# EAGLE schematic BLT_Preliminary_Avionics_Schematic_Brandon_update_August_8_2021 (EAGLE 9.6.2)
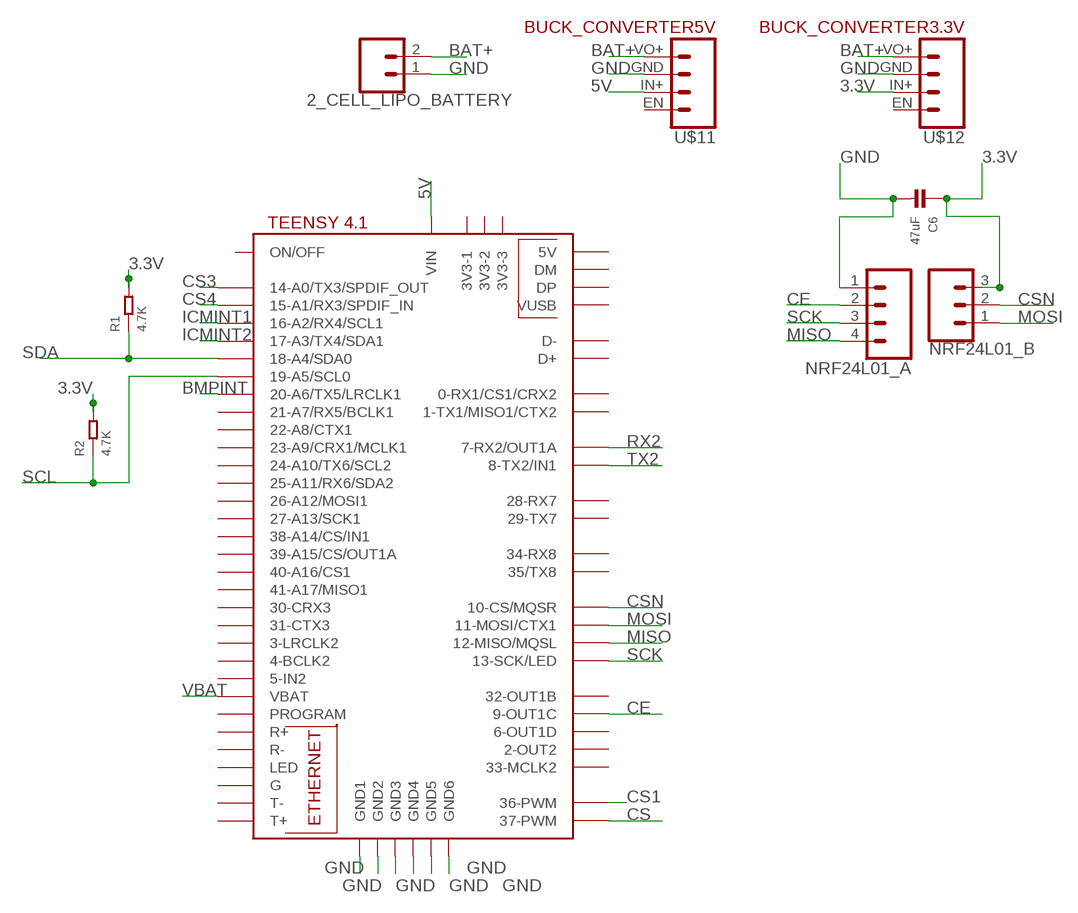
[diagram p0: schematic, sheet 1, part 1 of 2]
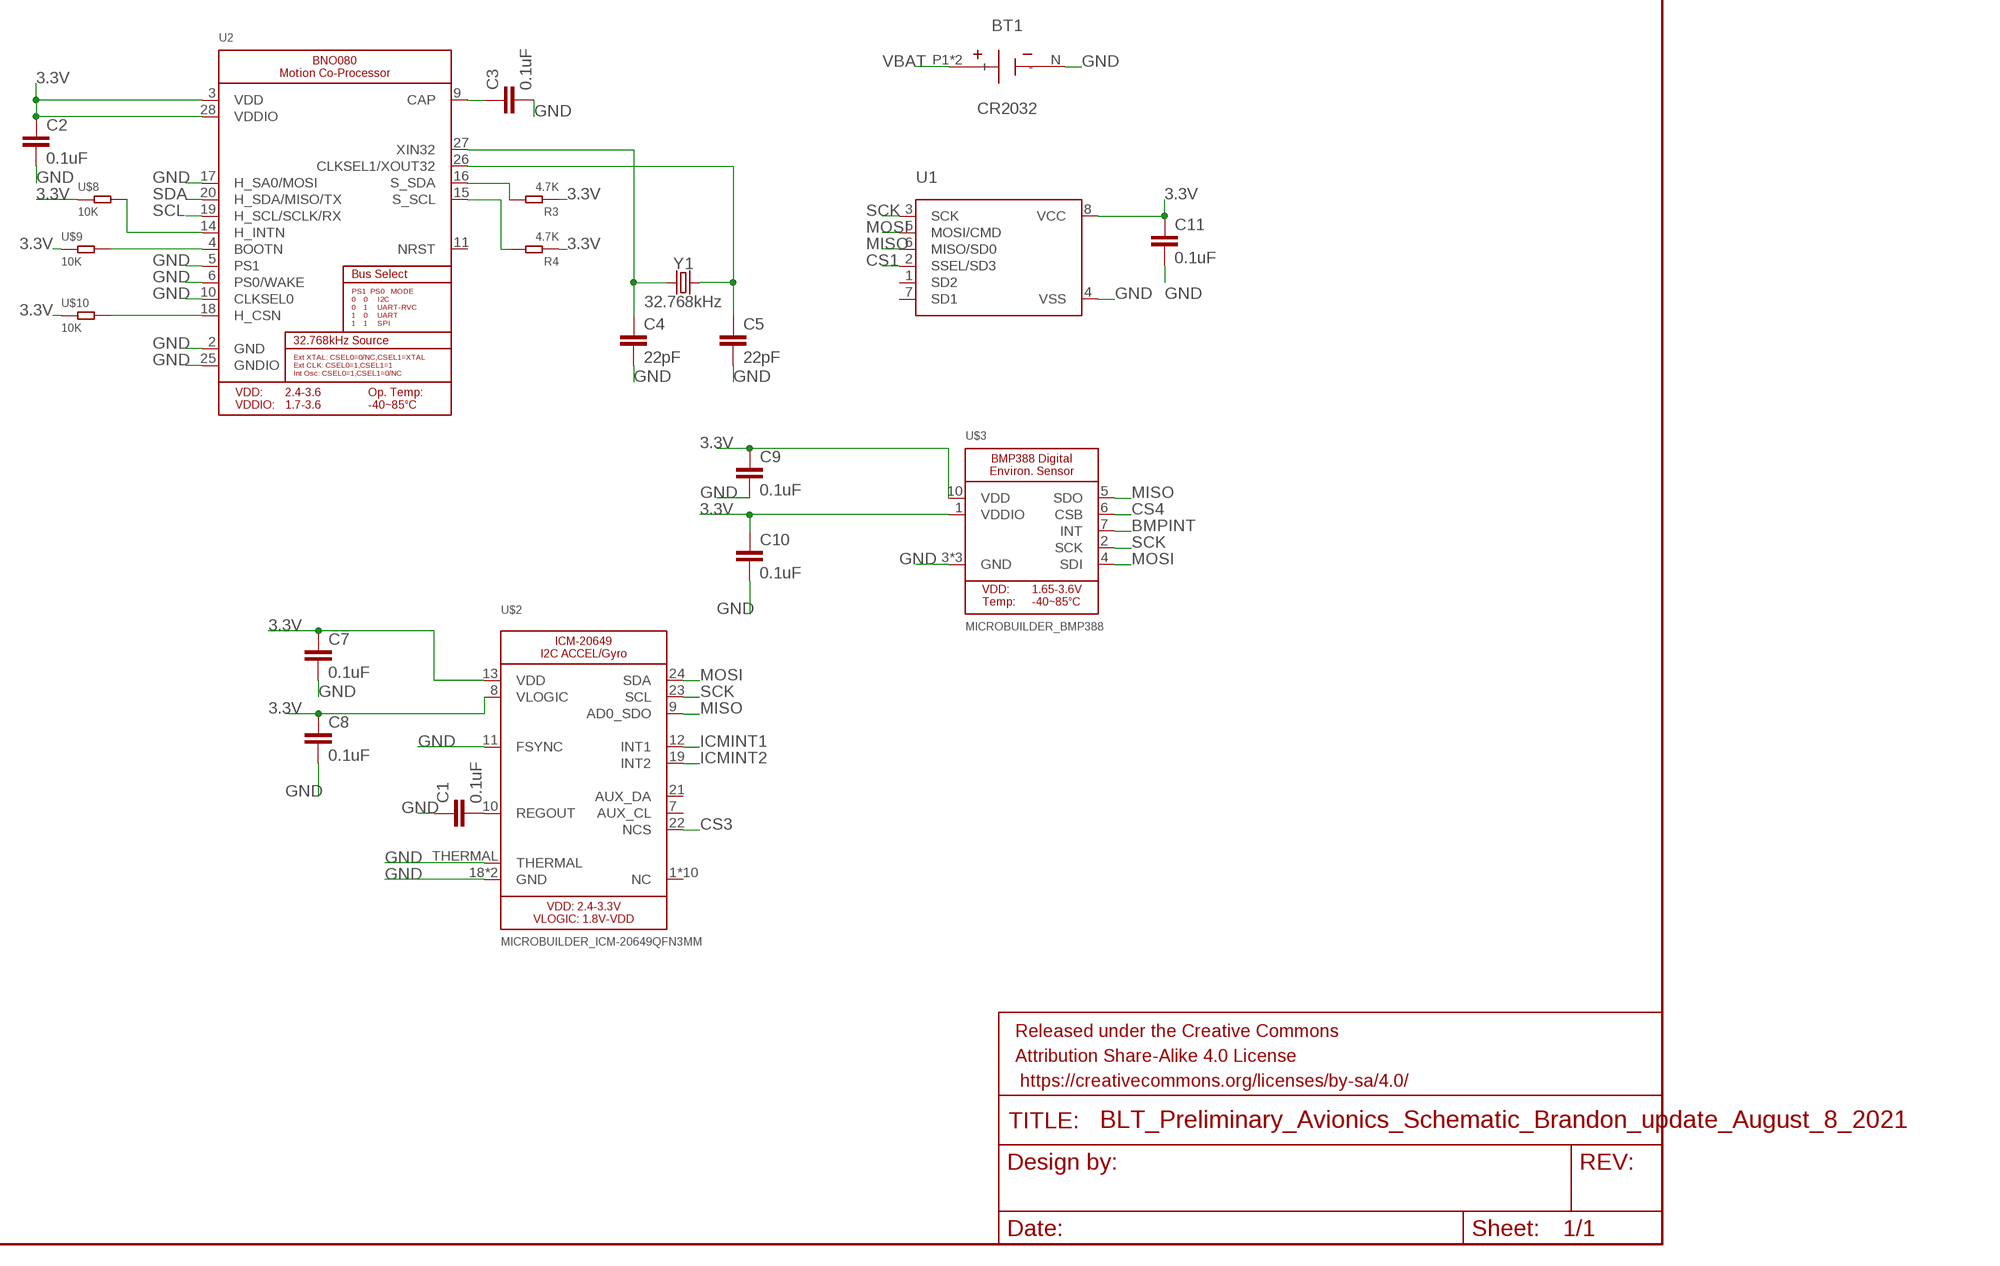
[diagram p1: schematic, sheet 1, part 2 of 2]

## Parts
2_CELL_LIPO_BATTERY  CONN_02  [1X02]
BT1  CR2032  COIN-CELL-THM-3P-3003-CR2032  [BAT_3003]
C1  0.1uF  0.1UF-0402-16V-10%  [0402]
C2  0.1uF  0.1UF-0402-16V-10%  [0402]
C3  0.1uF  0.1UF-0402-16V-10%  [0402]
C4  22pF  22PF-0603-50V-5%  [0603]
C5  22pF  22PF-0603-50V-5%  [0603]
C6  47uF  CAP_CERAMIC0805  [0805]
C7  0.1uF  0.1UF-0603-100V-10%  [0603]
C8  0.1uF  0.1UF-0603-100V-10%  [0603]
C9  0.1uF  0.1UF-0603-100V-10%  [0603]
C10  0.1uF  0.1UF-0603-100V-10%  [0603]
C11  0.1uF  0.1UF-0603-100V-10%  [0603]
FRAME1  FRAME-LEDGER  [CREATIVE_COMMONS]
NRF24L01_A  CONN_04  [1X04]
NRF24L01_B  CONN_03  [1X03]
R1  4.7K  SMD-RES-4.7K-5%-1/16W(0402)  [R0402]
R2  4.7K  SMD-RES-4.7K-5%-1/16W(0402)  [R0402]
R3  4.7K  SMD-RES-4.7K-5%-1/16W(0402)  [R0402]
R4  4.7K  SMD-RES-4.7K-5%-1/16W(0402)  [R0402]
U1  MICROBUILDER_SMT_SDCARD_8PIN  [MICROBUILDER_LGA8_8X6]
U2  MICROBUILDER_BNO080  [MICROBUILDER_BNO080]
U$1  TEENSY41  [TEENSY41]
U$2  MICROBUILDER_ICM-20649QFN3MM  [MICROBUILDER_QFN24_3MM]
U$3  MICROBUILDER_BMP388  [MICROBUILDER_BMP388]
U$8  10K  SMD-RES-10K-5%-1/(0402)  [R0402]
U$9  10K  SMD-RES-10K-5%-1/(0402)  [R0402]
U$10  10K  SMD-RES-10K-5%-1/(0402)  [R0402]
U$11  BUCK_CONVERTER5V  [1X04]
U$12  BUCK_CONVERTER3.3V  [1X04]
Y1  32.768kHz  CRYSTAL-32.768KHZSMD-3.2X1.5  [CRYSTAL-SMD-3.2X1.5MM]

## Nets
3.3V: C2.1 C6.1 C7.1 C8.1 C9.1 C10.1 C11.1 NRF24L01_B.3 R1.2 R2.2 R3.1 R4.1 U1.8(VCC) U2.3(VDD) U2.28(VDDIO) U$2.8(VLOGIC) U$2.13(VDD) U$3.1(VDDIO) U$3.10(VDD) U$8.1 U$9.1 U$10.1 U$12.IN+
5V: U$1.VIN U$11.IN+
BAT+: 2_CELL_LIPO_BATTERY.2 U$11.VO+ U$12.VO+
BMPINT: U$1.20-A6/TX5/LRCLK1 U$3.7(INT)
CE: NRF24L01_A.2 U$1.9-OUT1C
CS: U$1.37-PWM
CS1: U1.2(SSEL/SD3) U$1.36-PWM
CS3: U$1.14-A0/TX3/SPDIF_OUT U$2.22(NCS)
CS4: U$1.15-A1/RX3/SPDIF_IN U$3.6(CSB)
CSN: NRF24L01_B.2 U$1.10-CS\MQSR(10-CS/MQSR)
GND: 2_CELL_LIPO_BATTERY.1 BT1.N(-) C1.1 C2.2 C3.2 C4.2 C5.2 C6.2 C7.2 C8.2 C9.2 C10.2 C11.2 NRF24L01_A.1 U1.4(VSS) U2.2(GND) U2.5(PS1) U2.6(PS0/WAKE) U2.10(CLKSEL0) U2.17(H_SA0/MOSI) U2.25(GNDIO) U$1.GND1 U$1.GND2 U$1.GND3 U$1.GND4 U$1.GND5 U$1.GND6 U$2.11(FSYNC) U$2.18(GND) U$2.20(GND) U$2.THERMAL U$3.3(GND) U$3.8(GND) U$3.9(GND) U$11.GND U$12.GND
ICMINT1: U$1.16-A2/RX4/SCL1 U$2.12(INT1)
ICMINT2: U$1.17-A3/TX4/SDA1 U$2.19(INT2)
MISO: NRF24L01_A.4 U1.6(MISO/SD0) U$1.12-MISO/MQSL U$2.9(AD0_SDO) U$3.5(SDO)
MOSI: NRF24L01_B.1 U1.5(MOSI/CMD) U$1.11-MOSI/CTX1 U$2.24(SDA) U$3.4(SDI)
N$1: C1.2 U$2.10(REGOUT)
N$2: C4.1 U2.27(XIN32) Y1.P$1
N$3: R3.2 U2.16(S_SDA)
N$4: C5.1 U2.26(CLKSEL1/XOUT32) Y1.P$2
N$5: U2.18(H_CSN) U$10.2
N$6: R4.2 U2.15(S_SCL)
N$7: U2.14(H_INTN) U$8.2
N$8: U2.4(BOOTN) U$9.2
N$15: C3.1 U2.9(CAP)
RX2: U$1.7-RX2/OUT1A
SCK: NRF24L01_A.3 U1.3(SCK) U$1.13-SCK/LED U$2.23(SCL) U$3.2(SCK)
SCL: R2.1 U2.19(H_SCL/SCLK/RX) U$1.19-A5/SCL0
SDA: R1.1 U2.20(H_SDA/MISO/TX) U$1.18-A4/SDA0
TX2: U$1.8-TX2/IN1
VBAT: BT1.P1(+) BT1.P2(+) U$1.VBAT
Unconnected: U1.1(SD2) U1.7(SD1) U2.11(NRST) U$1.0-RX1/CS1/CRX2 U$1.1-TX1/MISO1/CTX2 U$1.2-OUT2 U$1.3-LRCLK2 U$1.3V3-1 U$1.3V3-2 U$1.3V3-3 U$1.4-BCLK2 U$1.5-IN2 U$1.6-OUT1D U$1.21-A7/RX5/BCLK1 U$1.22-A8/CTX1 U$1.23-A9/CRX1/MCLK1 U$1.24-A10/TX6/SCL2 U$1.25-A11/RX6/SDA2 U$1.26-A12/MOSI1 U$1.27-A13/SCK1 U$1.28-RX7 U$1.29-TX7 U$1.30-CRX3 U$1.31-CTX3 U$1.32-OUT1B U$1.33-MCLK2 U$1.34-RX8 U$1.35-TX8(35/TX8) U$1.38-A14/CS/IN1 U$1.39-A15/CS/OUT1A U$1.40-A16/CS1 U$1.41-A17/MISO1 U$1.+5V(5V) U$1.D+ U$1.D- U$1.DM U$1.DP U$1.G U$1.LED U$1.ON/OFF U$1.PROGRAM U$1.R+ U$1.R- U$1.T+ U$1.T- U$1.VUSB U$2.1(NC) U$2.2(NC) U$2.3(NC) U$2.4(NC) U$2.5(NC) U$2.6(NC) U$2.7(AUX_CL) U$2.14(NC) U$2.15(NC) U$2.16(NC) U$2.17(NC) U$2.21(AUX_DA) U$11.EN U$12.EN

## Library data of the parts
2_CELL_LIPO_BATTERY = SparkFun-Connectors:CONN_02: Multi connection point. Often used as Generic Header-pin footprint for 0.1 inch spaced/style header connections On any of the 0.1 inch spaced packages, you can populate with these: Break Away Headers - Straight <https://www.sparkfun.com/products/116> (PRT-00116) Break Away Male Headers - Right Angle <https://www.sparkfun.com/products/553> (PRT-00553) Female Headers <https://www.sparkfun.com/products/115> (PRT-00115) Break Away Headers - Machine Pin <https://www.sparkfun.com/products/117> (PRT-00117) Break Away Female Headers - Swiss Machine Pin <https://www.sparkfun.com/products/743> (PRT-00743) For SCREWTERMINALS and SPRING TERMINALS visit here: Screw Terimnals on SparkFun.com <https://www.sparkfun.com/search/results?term=Screw+Terminals> (5mm/3.5mm/2.54mm spacing) This device is also useful as a general connection point to wire up your design to another part of your project. Our various solder wires solder well into these plated through hole pads. Hook-Up Wire - Assortment (Stranded, 22 AWG) <https://www.sparkfun.com/products/11375> (PRT-11375) Hook-Up Wire - Assortment (Solid Core, 22 AWG) <https://www.sparkfun.com/products/11367> (PRT-11367) View the entire wire category on our website here <https://www.sparkfun.com/categories/141> Special notes: Molex polarized connector foot print use with: PRT-08233 with associated crimp pins and housings. 2.54_SCREWTERM for use with PRT-10571. 3.5mm Screw Terminal footprints for PRT-08084 5mm Screw Terminal footprints for use with PRT-08432
BT1 = Battery_Holder:COIN-CELL-THM-3P?-: Battery Holders - Coin Cell THT - CR2032, LR44, SR44 etc. Datasheet <https://docs.rs-online.com/b397/0900766b813ec0e2.pdf>; CATEGORY: Battery-Holder; CELL_DIAMETER: 20mm; DESCRIPTION: Battery Retainer Coin, 20.0mm 1 Cell PC Pin; MANUFACTURER: Keystone Electronics; MPN: 3003; PART_STATUS: ACTIVE; ROHS_COMPLIANT: COMPLIANT; SERIES: -; SUB_CATEGORY: Holder; TYPE: Coin Cell
C1-C3 = SparkFun-Capacitors:0.1UF: 0.1µF ceramic capacitors A capacitor is a passive two-terminal electrical component used to store electrical energy temporarily in an electric field.; PROD_ID: CAP-12416
C4 C5 = SparkFun-Capacitors:22PF: 22pF ceramic capacitors A capacitor is a passive two-terminal electrical component used to store electrical energy temporarily in an electric field.; PROD_ID: CAP-07876
C6 = microbuilder:CAP_CERAMIC: Ceramic Capacitors 0402 - 0402 Surface Mount Capacitors 16pF 50V 5% [Digikey: 445-4899-2-ND] 18pF 50V 5% [Digikey: 490-1281-2-ND] 22pF 50V 5% [Digikey: 490-1283-2-ND] 68pF 50V 5% [Digikey: 490-1289-2-ND] 0.1uF 10V 10% [Digikey: 490-1318-2-ND] 1.0uF 6.3V 10% [Digikey: 490-1320-2-ND] 0603 - 0603 Surface Mount Capacitors 16 pF 50V 5% [Digikey: 445-5051-2-ND] 22 pF 50V [Digikey: PCC220ACVTR-ND] 33 pF 50V 5% [Digikey: 490-1415-1-ND] 56pF 50V 5% [Digikey: 490-1421-1-ND] 220pF 50V 5% [Digikey: 445-1285-1-ND] 680 pF 50V 2200 pF 50V 5% C0G [Digikey: 445-1297-1-ND] 5600 pF 100V 5% X7R [Digikey: 478-3711-1-ND] 0.1 µF 25V 10% [Digikey: PCC2277TR-ND] 0.22 µF 16V 10% X7R [Digikey: 445-1318-1-ND] 1.0 µF 25V 10% [Digikey: 445-5146-2-ND] 0603 - RF Specific 3pF 250V +/-0.1pF RF [Digikey: 712-1347-1-ND] 18 pF 250V 5% [Digikey: 478-3505-1-ND or 712-1322-1-ND] 56 pF 250V 5% C0G RF [Digikey: 490-4867-1-ND] 68 pF 250V RF [Digikey: 490-4868-1-ND] 0805 - 0805 Surface Mount Capacitors 220 pF 250V 2% RF Ceramic Capacitor [Digikey: 712-1398-1-ND] 1000 pF 50V 2% NP0 Ceramic Capacitor [Digikey: 478-3760-1-ND] 0.1 µF 25V 10% Ceramic Capacitor [Digikey: PCC1828TR-ND] 1.0 µF 16V 10% Ceramic Capacitor[Digikey: 490-1691-2-ND] 10.0 µF 10V 10% Ceramic Capacitor[Digikey: 709-1228-1-ND] 10.0 uF 16V 10% Ceramic Capacitor [Digikey: 478-5165-2-ND] 47 uF 6.3V 20% Ceramic Capacitor [Digikey: 587-1779-1-ND or 399-5506-1-ND] 1206 - 1206 Surface Mount Capacitors 47uF 10V 20% Ceramic Capacitor [Digikey: 490-5528-1-ND or 399-5508-1-ND or 445-6010-1-ND] 100uF 6.3V -20%, +80% Y5V Ceramic Capacitor (Digikey: 490-4512-1-ND, Mouser: 81-GRM31CF50J107ZE1L)
C7-C11 = SparkFun-Capacitors:0.1UF: 0.1µF ceramic capacitors A capacitor is a passive two-terminal electrical component used to store electrical energy temporarily in an electric field.; PROD_ID: CAP-08390
FRAME1 = SparkFun-Aesthetics:FRAME-LEDGER: Schematic Frame - Ledger Standard 11x14 US Ledger frame
NRF24L01_A = SparkFun-Connectors:CONN_04: Multi connection point. Often used as Generic Header-pin footprint for 0.1 inch spaced/style header connections On any of the 0.1 inch spaced packages, you can populate with these: Break Away Headers - Straight <https://www.sparkfun.com/products/116> (PRT-00116) Break Away Male Headers - Right Angle <https://www.sparkfun.com/products/553> (PRT-00553) Female Headers <https://www.sparkfun.com/products/115> (PRT-00115) Break Away Headers - Machine Pin <https://www.sparkfun.com/products/117> (PRT-00117) Break Away Female Headers - Swiss Machine Pin <https://www.sparkfun.com/products/743> (PRT-00743) For SCREWTERMINALS and SPRING TERMINALS visit here: Screw Terimnals on SparkFun.com <https://www.sparkfun.com/search/results?term=Screw+Terminals> (5mm/3.5mm/2.54mm spacing) This device is also useful as a general connection point to wire up your design to another part of your project. Our various solder wires solder well into these plated through hole pads. Hook-Up Wire - Assortment (Stranded, 22 AWG) <https://www.sparkfun.com/products/11375> (PRT-11375) Hook-Up Wire - Assortment (Solid Core, 22 AWG) <https://www.sparkfun.com/products/11367> (PRT-11367) View the entire wire category on our website here <https://www.sparkfun.com/categories/141> Special notes: Molex polarized connector foot print use with SKU : PRT-08231 with associated crimp pins and housings. 1MM SMD Version SKU: PRT-10208; PROD_ID: CONN-09696
NRF24L01_B = SparkFun-Connectors:CONN_03: Multi connection point. Often used as Generic Header-pin footprint for 0.1 inch spaced/style header connections On any of the 0.1 inch spaced packages, you can populate with these: Break Away Headers - Straight <https://www.sparkfun.com/products/116> (PRT-00116) Break Away Male Headers - Right Angle <https://www.sparkfun.com/products/553> (PRT-00553) Female Headers <https://www.sparkfun.com/products/115> (PRT-00115) Break Away Headers - Machine Pin <https://www.sparkfun.com/products/117> (PRT-00117) Break Away Female Headers - Swiss Machine Pin <https://www.sparkfun.com/products/743> (PRT-00743) Stackable Header - 3 Pin (Female, 0.1") <https://www.sparkfun.com/products/13875> (PRT-13875) For SCREWTERMINALS and SPRING TERMINALS visit here: Screw Terimnals on SparkFun.com <https://www.sparkfun.com/search/results?term=Screw+Terminals> (5mm/3.5mm/2.54mm spacing) This device is also useful as a general connection point to wire up your design to another part of your project. Our various solder wires solder well into these plated through hole pads. Hook-Up Wire - Assortment (Stranded, 22 AWG) <https://www.sparkfun.com/products/11375> (PRT-11375) Hook-Up Wire - Assortment (Solid Core, 22 AWG) <https://www.sparkfun.com/products/11367> (PRT-11367) View the entire wire category on our website here <https://www.sparkfun.com/categories/141> Special notes: Molex polarized connector foot print use with SKU : PRT-08232 with associated crimp pins and housings.
R1-R4 = OPL_Resistor:SMD-RES-4.7K-5%-1/16W(0402): 301012026; MPN: RC0402JR-074K7L
U1 = Adafruit SPI Flash SD Card:MICROBUILDER_SMT_SDCARD_8PIN: SOIC8 SPI Flash Be careful with the size since SOIC8 flash comes in several 'widths' SOIC8 150 mil M25P16 - 16Mbit (2Mbit x 8) Serial Flash (75MHz SPI Bus), Supply: 2.7-3.6V Digikey: SOIC8 - M25P16-VMN6P-ND SOIC8 208 mil W25Q16BVSSIG - 16Mbit (2Mbit x 8) Serial Flash (104MHz SPI Bus), Supply: 2.7-3.6V Digikey: SOIC8 - W25Q16BVSSIG-ND
U2 = Adafruit_BNO08x:MICROBUILDER_BNO080: BNO080 - Motion Co-Processor
U$1 = teensy:TEENSY41
U$2 = Adaruit ICM20649:MICROBUILDER_ICM-20649
U$3 = Adafruit BMP390:MICROBUILDER_BMP388
U$8-U$10 = OPL_Resistor:SMD-RES-10K-5%-1/(0402): 301010004; MPN: RC0402JR-0710KL
U$11 = BLTFootprints:BUCK_CONVERTER; VOLTAGE: 5V
U$12 = BLTFootprints:BUCK_CONVERTER; VOLTAGE: 3.3V
Y1 = SparkFun-Clocks:CRYSTAL-32.768KHZ: 32.768kHz Crystal Frequency: 32.768kHz Frequency Stability: ±20ppm Load Capacitance: 12.5pF (PTH-2X6 & SMD-3.2X1.5), 6pF (SMD-2X6) SparkFun Products: SparkFun BigTime Watch Kit <https://www.sparkfun.com/products/11734> SparkFun nRF52832 Breakout <https://www.sparkfun.com/products/13990> SparkFun Real Time Clock Module <https://www.sparkfun.com/products/12708>; PROD_ID: XTAL-13062